# Altium schematic sheet [10]-MODEM_CONNECTORS.SchDoc
size A4
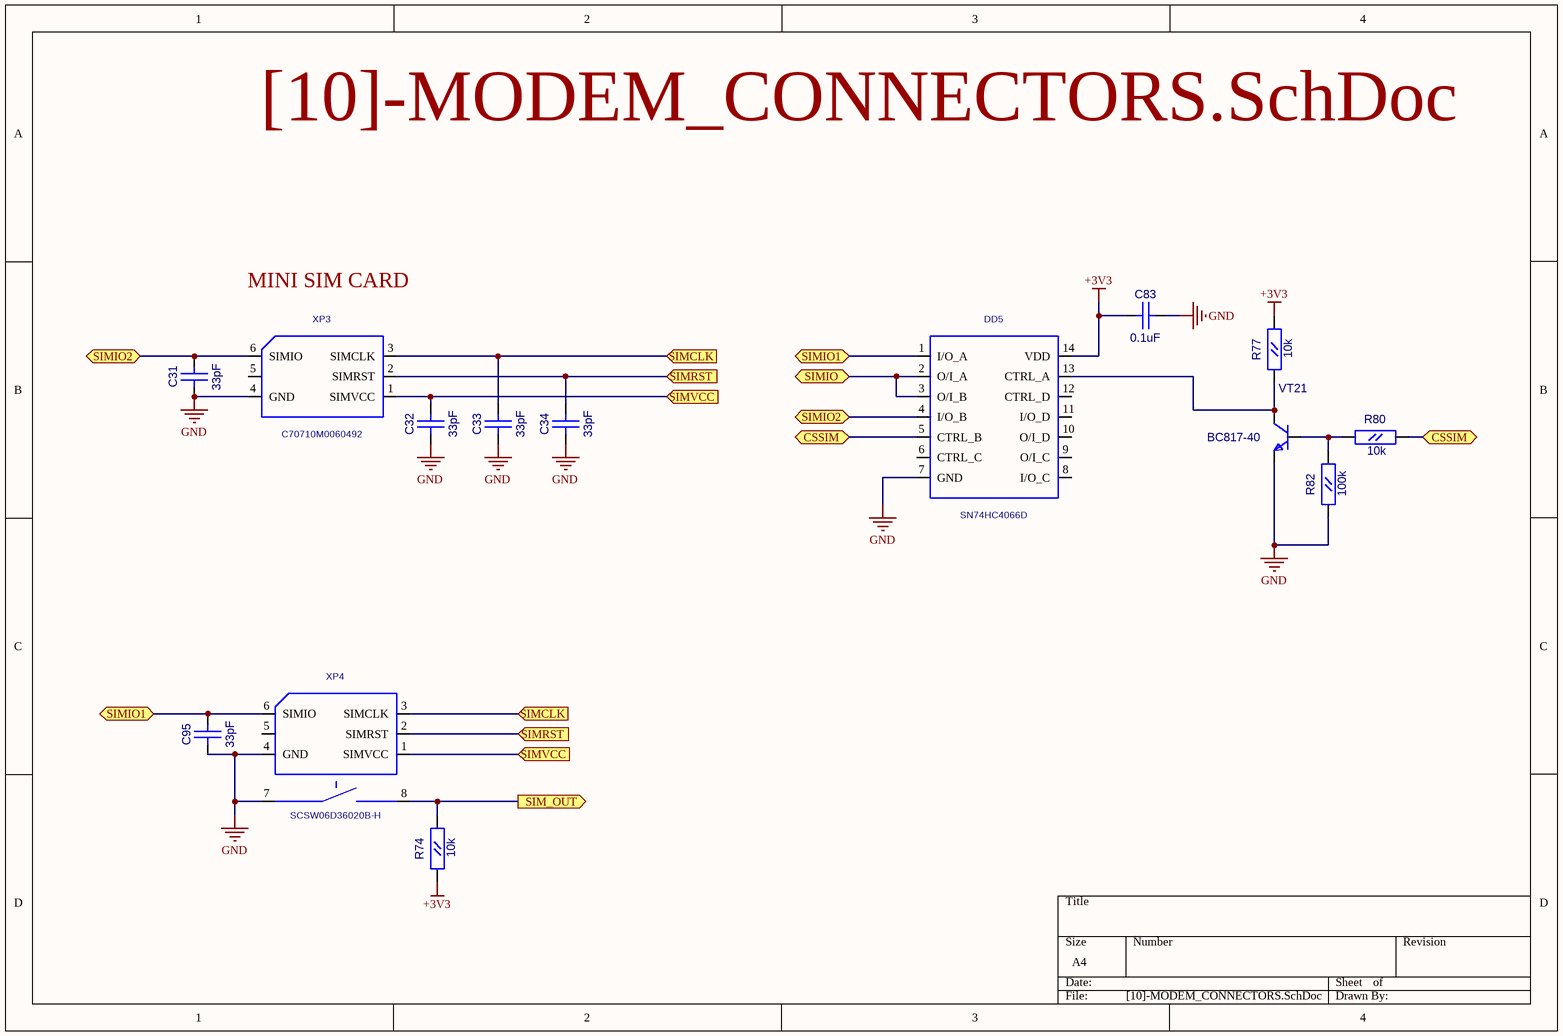
[diagram p0: [10]-MODEM_CONNECTORS.SchDoc]

## Parts
C31  33pF  [CC0603]
C32  33pF  [CC0603]
C33  33pF  [CC0603]
C34  33pF  [CC0603]
C83  0.1uF  [CC0603]
C95  33pF  [CC0603]
DD5  SN74HC4066D  [SO14]
R74  10k  [RC0603]
R77  10k  [RC0603]
R80  10k  [RC0603]
R82  100k  [RC0603]
VT21  BC817-40  [SOT-23(123)]
XP3  C70710M0060492  [SCVW06A25020]
XP4  SCSW06D36020B-H  [SCSW06D36020B-H]

## Ports
CSSIM (bidir), SIM_OUT (out), SIMCLK (in), SIMIO1 (bidir), SIMIO2 (bidir), SIMIO (bidir), SIMRST (in), SIMVCC (in)

## Nets
+3V3: C83.1(A) DD5.14(VDD) R74.1(A) R77.2(B)
GND: C31.1(A) C32.1(A) C33.1(A) C34.1(A) C83.2(B) C95.1(A) DD5.7(GND) R82.1(A) VT21.2(E) XP3.4(GND) XP4.4(GND) XP4.7
CSSIM: DD5.5(CTRL_B) R80.2(B) ; port CSSIM
SIM_OUT: R74.2(B) XP4.8 ; port SIM_OUT
SIMCLK: C33.2(B) XP3.3(SIMCLK) XP4.3(SIMCLK) ; port SIMCLK
SIMIO: DD5.2(O/I_A) DD5.3(O/I_B) ; port SIMIO
SIMIO1: C95.2(B) DD5.1(I/O_A) XP4.6(SIMIO) ; port SIMIO1
SIMIO2: C31.2(B) DD5.4(I/O_B) XP3.6(SIMIO) ; port SIMIO2
SIMRST: C34.2(B) XP3.2(SIMRST) XP4.2(SIMRST) ; port SIMRST
SIMVCC: C32.2(B) XP3.1(SIMVCC) XP4.1(SIMVCC) ; port SIMVCC
NetDD5_13: DD5.13(CTRL_A) R77.1(A) VT21.3(C)
NetR80_1: R80.1(A) R82.2(B) VT21.1(B)

Not connected (* = marked no-connect by the designer): DD5 6(CTRL_C) 8(I/O_C) 9(O/I_C) 10(O/I_D) 11(I/O_D) 12(CTRL_D); XP3 5; XP4 5

## Notes on the sheet
- MINI SIM CARD

## Library data of the parts
C31-C34 C83 C95 = CC0603
  C31-C34 C95: Value: 33pF
  C83: Value: 0.1uF
R74 R77 R80 R82 = RC0603
  R74 R77 R80: Value: 10k
  R82: Value: 100k
VT21 = BC846BLT1: NPN 500ma transistor; ComponentField7: Published 29-Sep-2000; OriginalName: BC846BLT1; Value: BC817-40
XP3 = SCV-W06A25-020: Value: *
DD5 = SN74HC4066D: Value: *
XP4 = SCSW06D36020B-H: Value: *